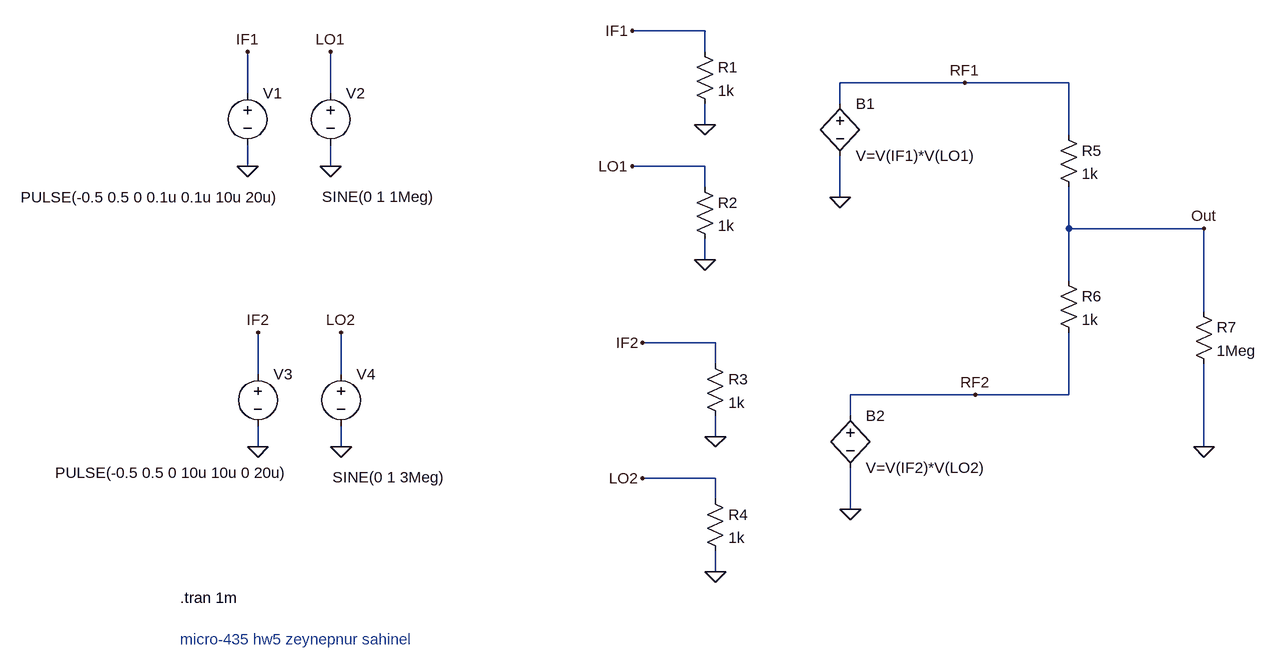
[diagram p0: schematic without bpf.asc]
without bpf.asc, the LTspice schematic file:
Version 4
SHEET 1 1048 680
WIRE 48 -304 -64 -304
WIRE 48 -272 48 -304
WIRE 448 -224 256 -224
WIRE 608 -224 448 -224
WIRE -656 -208 -656 -272
WIRE -528 -208 -528 -272
WIRE 256 -192 256 -224
WIRE 48 -160 48 -192
WIRE 608 -144 608 -224
WIRE -656 -96 -656 -128
WIRE -528 -96 -528 -128
WIRE 48 -96 -64 -96
WIRE 48 -64 48 -96
WIRE 256 -48 256 -112
WIRE 608 0 608 -64
WIRE 816 0 608 0
WIRE 48 48 48 16
WIRE 608 80 608 0
WIRE 816 128 816 0
WIRE 64 176 -48 176
WIRE 64 208 64 176
WIRE -640 224 -640 160
WIRE -512 224 -512 160
WIRE 464 256 272 256
WIRE 608 256 608 160
WIRE 608 256 464 256
WIRE 272 288 272 256
WIRE 64 320 64 288
WIRE -640 336 -640 304
WIRE -512 336 -512 304
WIRE 816 336 816 208
WIRE 64 384 -48 384
WIRE 64 416 64 384
WIRE 272 432 272 368
WIRE 64 528 64 496
FLAG 48 -160 0
FLAG -64 -304 IF1
FLAG 48 48 0
FLAG -64 -96 LO1
FLAG 256 -48 0
FLAG 448 -224 RF1
FLAG -656 -96 0
FLAG -528 -96 0
FLAG -656 -272 IF1
FLAG -528 -272 LO1
FLAG 64 320 0
FLAG -48 176 IF2
FLAG 64 528 0
FLAG -48 384 LO2
FLAG 272 432 0
FLAG 464 256 RF2
FLAG -640 336 0
FLAG -512 336 0
FLAG -640 160 IF2
FLAG -512 160 LO2
FLAG 816 336 0
FLAG 816 0 Out
DATAFLAG 816 0 ""
SYMBOL bv 256 -208 R0
SYMATTR InstName B1
SYMATTR Value V=V(IF1)*V(LO1)
SYMBOL res 32 -288 R0
SYMATTR InstName R1
SYMATTR Value 1k
SYMBOL res 32 -80 R0
SYMATTR InstName R2
SYMATTR Value 1k
SYMBOL voltage -656 -224 R0
WINDOW 3 -349 176 Left 2
WINDOW 123 0 0 Left 0
WINDOW 39 0 0 Left 0
SYMATTR Value PULSE(-0.5 0.5 0 0.1u 0.1u 10u 20u)
SYMATTR InstName V1
SYMBOL voltage -528 -224 R0
WINDOW 3 -13 175 Left 2
WINDOW 123 0 0 Left 0
WINDOW 39 0 0 Left 0
SYMATTR Value SINE(0 1 1Meg)
SYMATTR InstName V2
SYMBOL bv 272 272 R0
SYMATTR InstName B2
SYMATTR Value V=V(IF2)*V(LO2)
SYMBOL res 48 192 R0
SYMATTR InstName R3
SYMATTR Value 1k
SYMBOL res 48 400 R0
SYMATTR InstName R4
SYMATTR Value 1k
SYMBOL voltage -640 208 R0
WINDOW 3 -312 168 Left 2
WINDOW 123 0 0 Left 0
WINDOW 39 0 0 Left 0
SYMATTR Value PULSE(-0.5 0.5 0 10u 10u 0 20u)
SYMATTR InstName V3
SYMBOL voltage -512 208 R0
WINDOW 3 -13 175 Left 2
WINDOW 123 0 0 Left 0
WINDOW 39 0 0 Left 0
SYMATTR Value SINE(0 1 3Meg)
SYMATTR InstName V4
SYMBOL res 592 -160 R0
SYMATTR InstName R5
SYMATTR Value 1k
SYMBOL res 592 64 R0
SYMATTR InstName R6
SYMATTR Value 1k
SYMBOL res 800 112 R0
SYMATTR InstName R7
SYMATTR Value 1Meg
TEXT -760 632 Left 2 ;micro-435 hw5 zeynepnur sahinel
TEXT -760 568 Left 2 !.tran 1m

The netlist it stands for:
* without bpf.asc
B1 RF1 0 V=V(IF1)*V(LO1)
R1 IF1 0 1k
R2 LO1 0 1k
V1 IF1 0 PULSE(-0.5 0.5 0 0.1u 0.1u 10u 20u)
V2 LO1 0 SINE(0 1 1Meg)
B2 RF2 0 V=V(IF2)*V(LO2)
R3 IF2 0 1k
R4 LO2 0 1k
V3 IF2 0 PULSE(-0.5 0.5 0 10u 10u 0 20u)
V4 LO2 0 SINE(0 1 3Meg)
R5 RF1 Out 1k
R6 Out RF2 1k
R7 Out 0 1Meg
* micro-435 hw5 zeynepnur sahinel
.tran 1m
.backanno
.end